# EAGLE design main_traced (EAGLE 9.6.2)
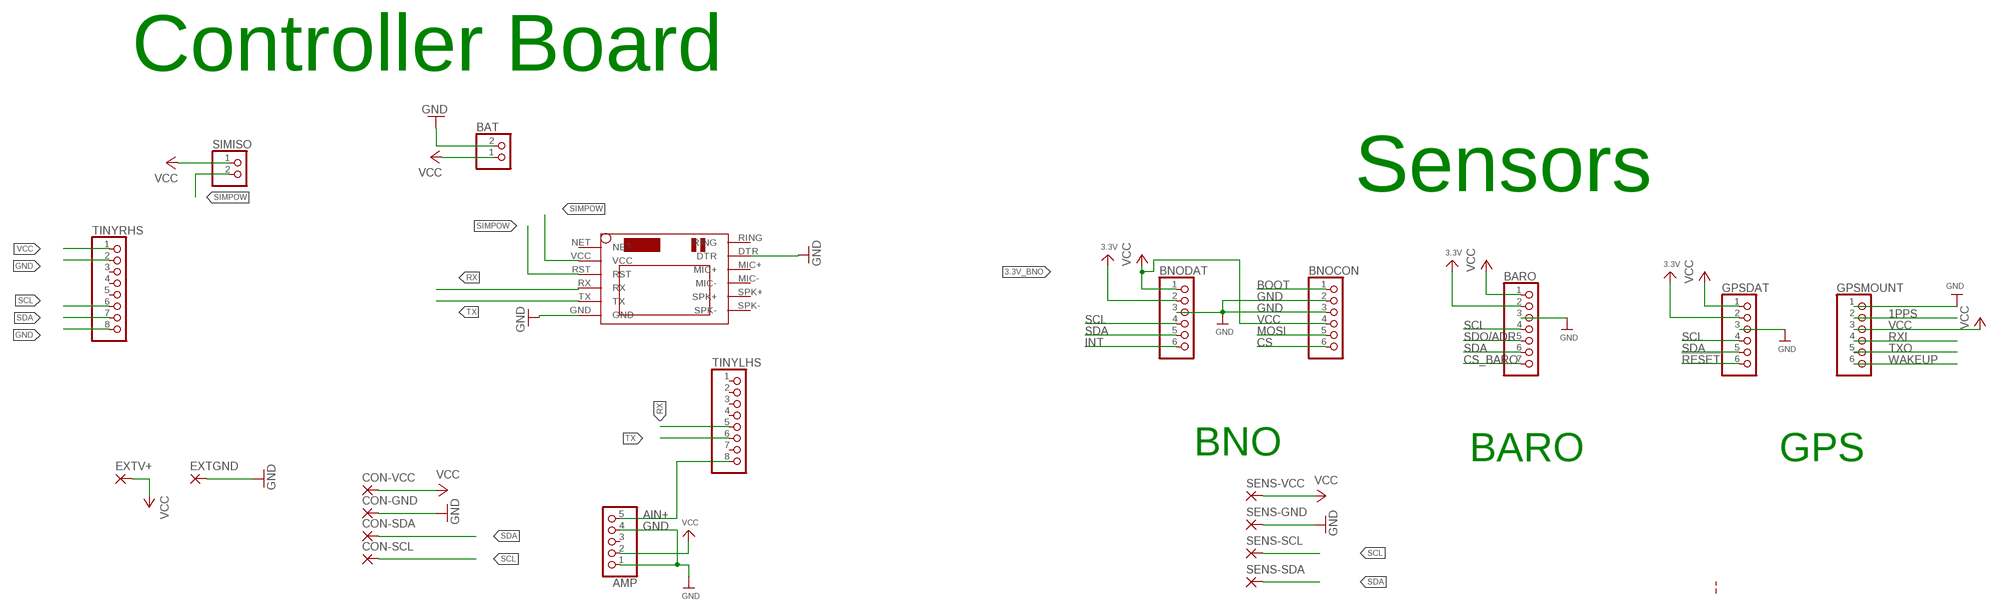
[diagram p0: schematic, sheet 1]

## Parts
AMP  HEADER-1X570MIL  [1X05_ROUND_70]
BARO  HEADER-1X770MIL  [1X07_ROUND_70]
BAT  JST_2PIN-THM-RA  [JST-PH-2-THM-RA]
BNOCON  HEADER-1X670MIL  [1X06_ROUND_70]
BNODAT  HEADER-1X670MIL  [1X06_ROUND_70]
CON-GND  3,17/1,3  [3,17/1,3]
CON-SCL  3,17/1,3  [3,17/1,3]
CON-SDA  3,17/1,3  [3,17/1,3]
CON-VCC  3,17/1,3  [3,17/1,3]
EXTGND  SMD5  [SMD2,54-5,08]
EXTV+  SMD5  [SMD2,54-5,08]
GPSDAT  HEADER-1X670MIL  [1X06_ROUND_70]
GPSMOUNT  HEADER-1X670MIL  [1X06_ROUND_70]
SENS-GND  3,17/1,3  [3,17/1,3]
SENS-SCL  3,17/1,3  [3,17/1,3]
SENS-SDA  3,17/1,3  [3,17/1,3]
SENS-VCC  3,17/1,3  [3,17/1,3]
SIMISO  PINHD-1X2  [1X02]
TINYLHS  PINHD-1X8  [1X08]
TINYRHS  PINHD-1X8  [1X08]
U$1  SIM800LMODULE  [SIM800LMODULE]

## Nets
1PPS: GPSMOUNT.2
3.3V_2 [lowpower]: BARO.2 ; supply symbol labelled 3.3V
3.3V_3 [lowpower]: GPSDAT.2 ; supply symbol labelled 3.3V
3.3V_BNO [lowpower]: BNODAT.2 ; supply symbol labelled 3.3V
!RESET: GPSDAT.6
AIN+: AMP.5 TINYLHS.8
BOOT: BNOCON.1
CS: BNOCON.6
CS_BARO: BARO.7
GND: AMP.1 AMP.4 BARO.3 BAT.2 BNOCON.2 BNOCON.3 BNODAT.3 CON-GND.1(P) EXTGND.1(P) GPSDAT.3 GPSMOUNT.1 SENS-GND.1(P) TINYRHS.2 TINYRHS.8 U$1.DTR U$1.GND
INT: BNODAT.6
MOSI: BNOCON.5
RX: TINYLHS.5 U$1.RX
RXI: GPSMOUNT.4
SCL: BARO.4 BNODAT.4 CON-SCL.1(P) GPSDAT.4 SENS-SCL.1(P) TINYRHS.6
SDA: BARO.6 BNODAT.5 CON-SDA.1(P) GPSDAT.5 SENS-SDA.1(P) TINYRHS.7
SDO/ADR: BARO.5
SIMPOW: SIMISO.2 U$1.RST U$1.VCC
TX: TINYLHS.6 U$1.TX
TXO: GPSMOUNT.5
VCC: AMP.2 BARO.1 BAT.1 BNOCON.4 BNODAT.1 CON-VCC.1(P) EXTV+.1(P) GPSDAT.1 GPSMOUNT.3 SENS-VCC.1(P) SIMISO.1 TINYRHS.1
WAKEUP: GPSMOUNT.6
Unconnected: AMP.3 TINYLHS.1 TINYLHS.2 TINYLHS.3 TINYLHS.4 TINYLHS.7 TINYRHS.3 TINYRHS.4 TINYRHS.5 U$1.MIC+ U$1.MIC- U$1.NET U$1.RING U$1.SPK+ U$1.SPK-

## Notes on the sheet
- Controller Board
- Sensors
- BNO | BARO | GPS

## Library data of the parts
AMP = microbuilder:HEADER-1X5: PIN HEADER
BARO = microbuilder:HEADER-1X7: PIN HEADER
BAT = adafruit:JST_2PIN: JST 2-Pin Connectors of various flavors SMT-RA (S2B-PH-SM4) 4UConnector #17311 SMT (B2B-PH-SM4) THM-RA (S2B-PH) THM (B2B-PH)
BNOCON BNODAT GPSDAT GPSMOUNT = microbuilder:HEADER-1X6: PIN HEADER
CON-GND CON-SCL CON-SDA CON-VCC SENS-GND SENS-SCL SENS-SDA SENS-VCC = wirepad:3,17/1,3: THROUGH-HOLE PAD
EXTGND EXTV+ = wirepad:SMD5: SMD PAD
SIMISO = pinhead:PINHD-1X2: PIN HEADER
TINYLHS TINYRHS = pinhead:PINHD-1X8: PIN HEADER
U$1 = SIM800LMODULE:SIM800LMODULE: SIM800L Module

## Net classes
1 highpower: width 0.406 mm, drill 0.483 mm
2 lowpower: width 0.305 mm, drill 0.483 mm

## Board
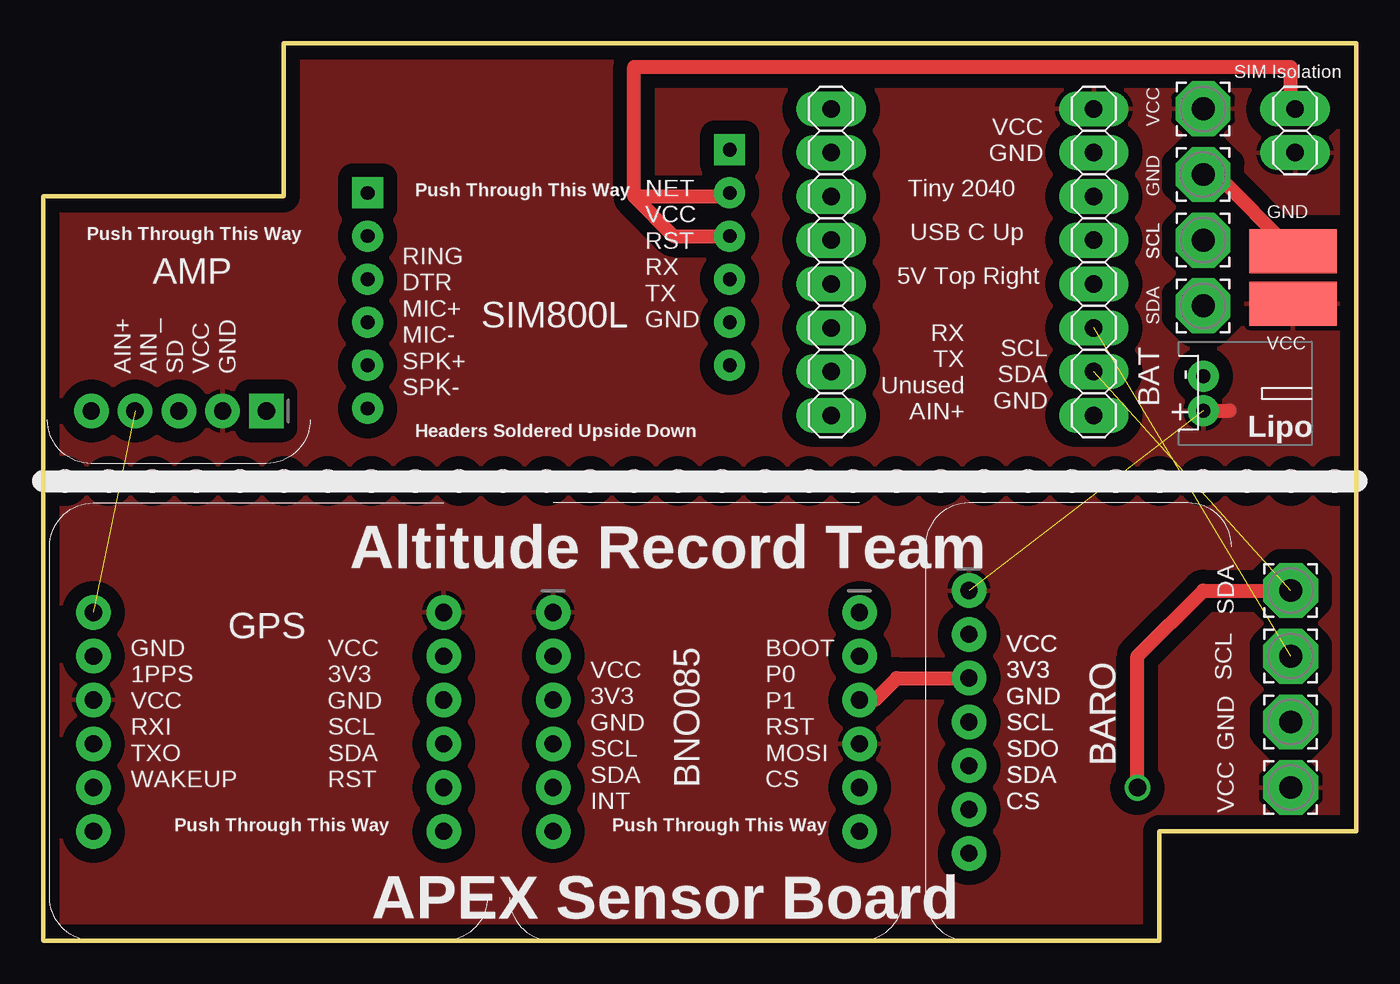
[diagram p1: board, top side]
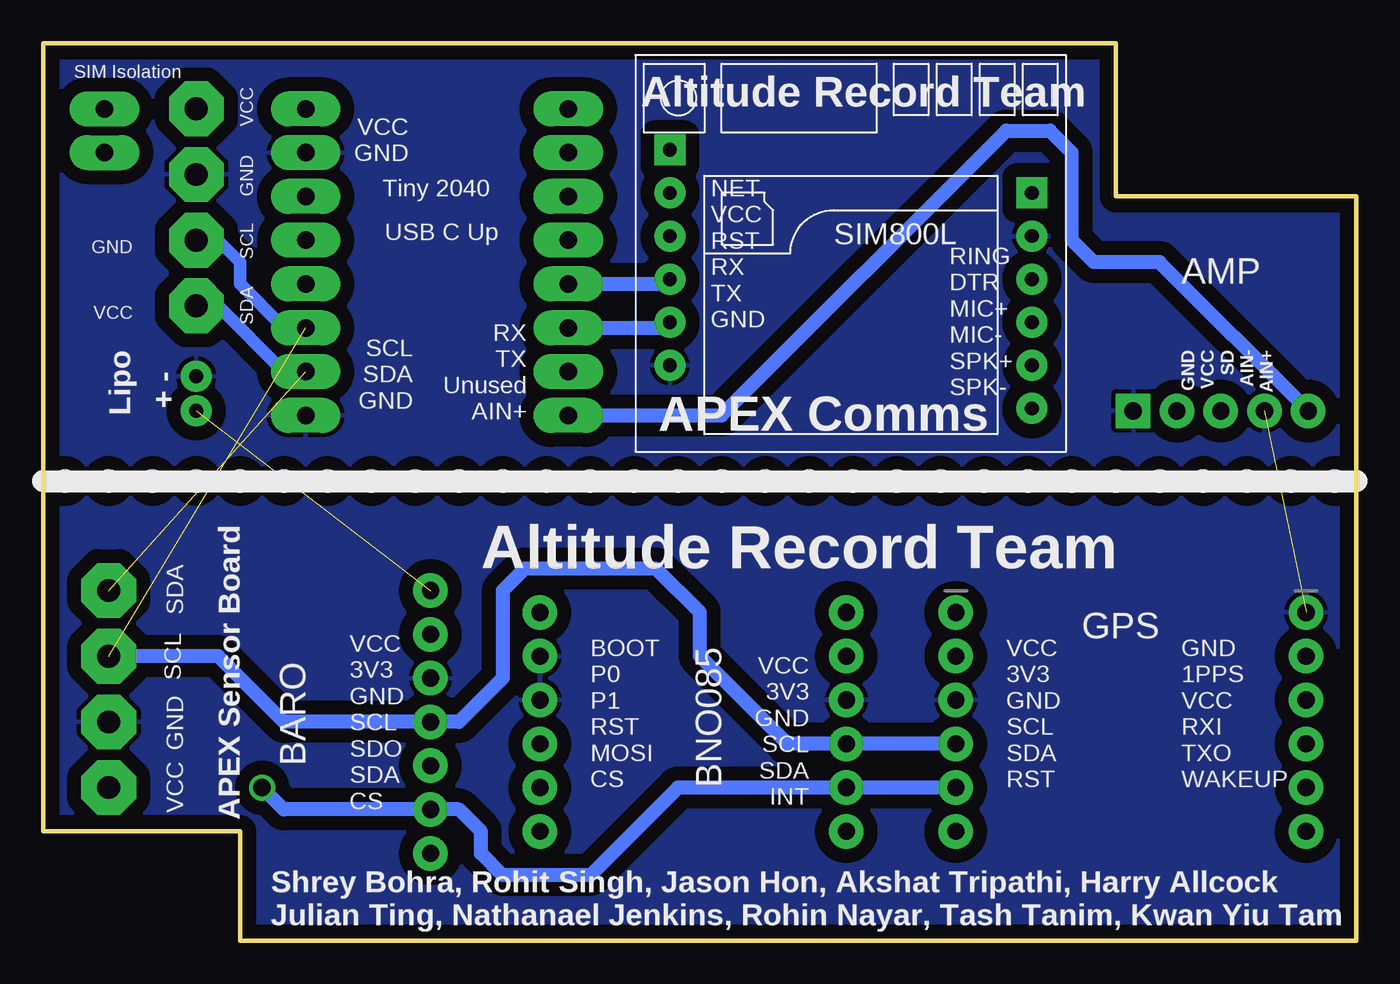
[diagram p2: board, bottom side, seen from below]

Size 76.2 x 52.07 mm. Coordinates in mm from the lower left corner, seen from the top.
Outline: 13.97,52.07 76.2,52.07 76.2,6.35 64.77,6.35 64.77,0 0,0 0,43.18 13.97,43.18 13.97,52.07
Copper layers (1*16): Top 0.035mm / dielectric 1.5mm / Bottom 0.035mm
Design rules "aisler_2_layer_simple *": minimum track width 0.1mm, minimum drill 1mm, track to track 0.5mm, track to pad 0.2mm, pad to pad 0.1mm, via to via 0.1mm, smd to smd 0.1mm, copper to edge 0.3mm, drill to drill 0.25mm, minimum pad ring 0.5mm, minimum via ring 0.2mm, stop-mask expansion 0mil, vias tented up to drill 0mil, thermal gap 10mil
Holes 1.27 mm at 1.27,26.67 3.81,26.67 6.35,26.67 8.89,26.67 11.43,26.67 13.97,26.67 16.51,26.67 19.05,26.67 21.59,26.67 24.13,26.67 26.67,26.67 29.21,26.67 31.75,26.67 34.29,26.67 36.83,26.67 39.37,26.67 41.91,26.67 44.45,26.67 46.99,26.67 49.53,26.67 52.07,26.67 54.61,26.67 57.15,26.67 59.69,26.67 62.23,26.67 64.77,26.67 67.31,26.67 69.85,26.67 72.39,26.67 74.93,26.67

### Footprints (pad centres in the part's own frame; a part is rotated, then mirrored left to right if it is on the bottom)
1X05_ROUND_70 = drill 1 pad 1.778 square: 1 -5.08,0 | drill 1 pad 1.778: 2 -2.54,0; 3 0,0; 4 2.54,0; 5 5.08,0
1X07_ROUND_70 = drill 1 pad 1.778: 1 -7.62,0; 2 -5.08,0; 3 -2.54,0; 4 0,0; 5 2.54,0; 6 5.08,0; 7 7.62,0
JST-PH-2-THM-RA = drill 0.8 pad 1.422: 1 1,0; 2 -1,0
1X06_ROUND_70 = drill 1 pad 1.778: 1 -6.35,0; 2 -3.81,0; 3 -1.27,0; 4 1.27,0; 5 3.81,0; 6 6.35,0
3,17/1,3 = drill 1.321 pad 3.175 octagon: 1 0,0
SMD2,54-5,08 = smd 2.54 x 5.08: 1 0,0
1X02 = drill 1.016 long: 1 -1.27,0; 2 1.27,0
1X08 = drill 1.016 long: 1 -8.89,0; 2 -6.35,0; 3 -3.81,0; 4 -1.27,0; 5 1.27,0; 6 3.81,0; 7 6.35,0; 8 8.89,0
SIM800LMODULE = drill 0.8: DTR 10.5,1; GND -10.5,-6.5; MIC+ 10.5,-1.5; MIC- 10.5,-4; RST -10.5,1; RX -10.5,-1.5; SPK+ 10.5,-6.5; SPK- 10.5,-9; TX -10.5,-4; VCC -10.5,3.5 | drill 0.8 square: NET -10.5,6; RING 10.5,3.5

### Placement (x,y rotation side)
AMP  7.87,30.73 180 top
BARO  53.72,12.7 270 top
BAT  67.31,31.75 270 top
BNOCON  47.37,12.7 270 top
BNODAT  29.59,12.7 270 top
CON-GND  67.31,44.45 0 top
CON-SCL  67.31,40.64 0 top
CON-SDA  67.31,36.83 0 top
CON-VCC  67.31,48.26 0 top
EXTGND  72.52,40.01 90 top
EXTV+  72.52,36.96 90 top
GPSDAT  23.24,12.7 270 bottom
GPSMOUNT  2.92,12.7 270 bottom
SENS-GND  72.39,12.7 0 top
SENS-SCL  72.39,16.51 0 top
SENS-SDA  72.39,20.32 0 top
SENS-VCC  72.39,8.89 0 top
SIMISO  72.64,46.99 90 top
TINYLHS  45.72,39.37 270 top
TINYRHS  60.96,39.37 270 top
U$1  29.34,39.88 0 bottom

### Tracks (layer width: path | path; a pad name or v marks a point on that pad's centre or on a via)
AIN+
  Bottom 0.813: AMP.5 11.43,39.37 15.24,39.37 16.51,40.64 16.51,45.72 17.78,46.99 20.32,46.99 36.83,30.48 TINYLHS.8
GND  (1 unrouted)
  Top 0.813: EXTGND.1 68.07,44.45 CON-GND.1 | BNOCON.3 48.26,13.97 49.53,15.24 BARO.3
  pour Bottom (isolate 0.813): 0,43.18 13.97,43.18 13.97,52.07 76.2,52.07 76.2,6.35 64.77,6.35 64.77,0 0,0
RX
  Bottom 0.813: TINYLHS.5 40.11,38.1 U$1.RX
SCL  (1 unrouted)
  Bottom 0.711: TINYRHS.6 62.23,35.56 64.77,38.1 64.77,39.37 66.04,40.64 CON-SCL.1
  Bottom 0.813: GPSDAT.4 BNODAT.4 33.02,11.43 38.1,16.51 38.1,19.05 40.64,21.59 48.26,21.59 49.53,20.32 49.53,15.24 52.07,12.7 BARO.4 62.23,12.7 66.04,16.51 SENS-SCL.1
SDA  (via drill 1)  (1 unrouted)
  Top 0.813: v63.5,8.89 63.5,16.51 67.31,20.32 SENS-SDA.1
  Bottom 0.711: CON-SDA.1 66.04,36.83 62.23,33.02 TINYRHS.7
  Bottom 0.813: GPSDAT.5 BNODAT.5 39.37,8.89 44.45,3.81 49.53,3.81 50.8,5.08 50.8,6.35 52.07,7.62 BARO.6 62.23,7.62 v63.5,8.89
SIMPOW
  Top 0.813: 34.29,43.18 34.29,50.67 72.39,50.67 72.39,48.51 SIMISO.2 | 34.29,43.18 39.64,43.18 U$1.VCC | 34.29,43.18 36.59,40.88 U$1.RST
TX
  Bottom 0.813: TINYLHS.6 40.15,35.56 U$1.TX
VCC  (1 unrouted)
  Top 0.813: BAT.1 68.85,30.75
  pour Top (isolate 0.813): 0,43.18 13.97,43.18 13.97,52.07 76.2,52.07 76.2,6.35 64.77,6.35 64.77,0 0,0

### Text on the board
tPlace: Push Through This Way | Push Through This Way | APEX Sensor Board
bPlace: GND / VCC / SD / AIN- / AIN+ | APEX Sensor Board
tNames: SIM Isolation | VCC / GND | VCC | Push Through This Way | Tiny 2040 | GND | GND | SCL | SCL | Push Through This Way | USB C Up | AMP | 5V Top Right | SDA | SIM800L | NET / VCC / RST / RX / TX / GND | RX / TX / Unused / AIN+ | SCL / SDA / GND | VCC | AIN+ / AIN_ / SD / VCC / GND | RING / DTR / MIC+ / MIC- / SPK+ / SPK- | Lipo | Headers Soldered Upside Down | Altitude Record Team | SDA | GPS | GND | SCL | VCC | BARO | BARO | GND / 1PPS / VCC / RXI / TXO / WAKEUP | VCC / 3V3 / GND / SCL / SDA / RST | BNO085 | BOOT / P0 / P1 / RST / MOSI / CS | VCC / 3V3 / GND / SCL / SDA / INT | VCC / 3V3 / GND / SCL / SDO / SDA / CS | VCC / 3V3 / GND / SCL / SDO / SDA / CS
bNames: SIM Isolation | Altitude Record Team | VCC / GND | VCC | Tiny 2040 | GND | SCL | USB C Up | GND | AMP | SDA | NET / VCC / RST / RX / TX / GND | RX / TX / Unused / AIN+ | VCC | SCL / SDA / GND | + - | APEX Comms | RING / DTR / MIC+ / MIC- / SPK+ / SPK- | Lipo | Altitude Record Team | SDA | GPS | VCC / 3V3 / GND / SCL / SDA / INT | SCL | GND | VCC | BARO | GND / 1PPS / VCC / RXI / TXO / WAKEUP | VCC / 3V3 / GND / SCL / SDA / RST | BNO085 | BOOT / P0 / P1 / RST / MOSI / CS | VCC / 3V3 / GND / SCL / SDO / SDA / CS | Shrey Bohra, Rohit Singh, Jason Hon, Akshat Tripathi, Harry Allcock / Julian Ting, Nathanael Jenkins, Rohin Nayar, Tash Tanim, Kwan Yiu Tam